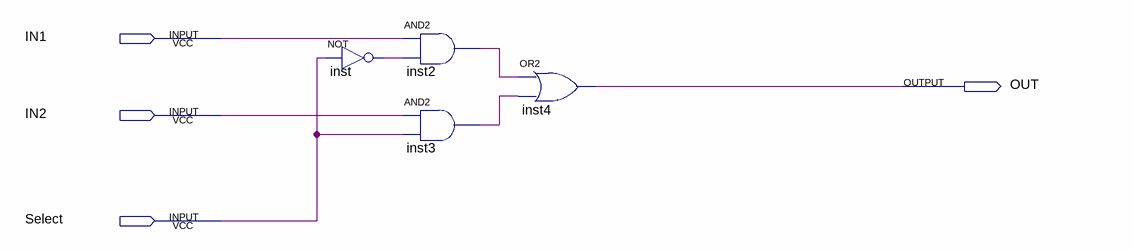
[diagram p0: schematic sheet]
// Quartus schematic Mux_2to1.bdf as structural Verilog: 4 symbols, 4 pins
module Mux_2to1 (
  input  IN1,
  input  IN2,
  input  Select,
  output OUT
);

  wire inst2_out, inst3_out, inst_out;

  not inst (inst_out, Select);
  and inst2 (inst2_out, IN1, inst_out);
  and inst3 (inst3_out, IN2, Select);
  or inst4 (OUT, inst2_out, inst3_out);
endmodule
